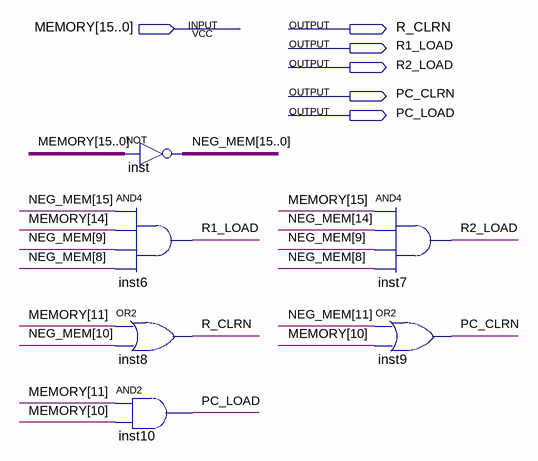
[diagram p0: schematic sheet]
// Quartus schematic ControlUnit.bdf as structural Verilog: 6 symbols, 6 pins
module ControlUnit (
  input  [15:0] MEMORY,
  output R_CLRN,
  output R1_LOAD,
  output R2_LOAD,
  output PC_CLRN,
  output PC_LOAD
);

  wire [15:0] NEG_MEM;

  assign NEG_MEM = ~MEMORY;  // NOT inst, 16 bits wide
  and inst6 (R1_LOAD, NEG_MEM[15], MEMORY[14], NEG_MEM[9], NEG_MEM[8]);
  or inst8 (R_CLRN, MEMORY[11], NEG_MEM[10]);
  and inst10 (PC_LOAD, MEMORY[11], MEMORY[10]);
  and inst7 (R2_LOAD, MEMORY[15], NEG_MEM[14], NEG_MEM[9], NEG_MEM[8]);
  or inst9 (PC_CLRN, NEG_MEM[11], MEMORY[10]);
endmodule
